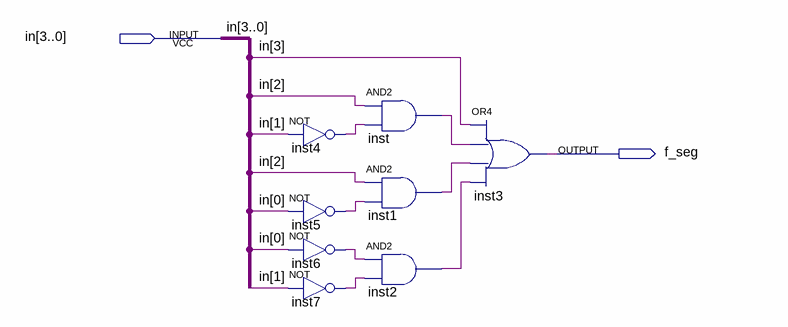
[diagram p0: schematic sheet]
// Quartus schematic f_seg.bdf as structural Verilog: 8 symbols, 2 pins
module f_seg (
  input  [3:0] in,
  output f_seg
);

  wire inst1_out, inst2_out, inst4_out, inst5_out, inst6_out, inst7_out, inst_out;

  not inst4 (inst4_out, in[1]);
  not inst5 (inst5_out, in[0]);
  not inst6 (inst6_out, in[0]);
  not inst7 (inst7_out, in[1]);
  and inst (inst_out, in[2], inst4_out);
  and inst1 (inst1_out, in[2], inst5_out);
  and inst2 (inst2_out, inst6_out, inst7_out);
  or inst3 (f_seg, in[3], inst_out, inst1_out, inst2_out);
endmodule
